# EAGLE design I2C-Level-Converter (EAGLE 7.6.0)
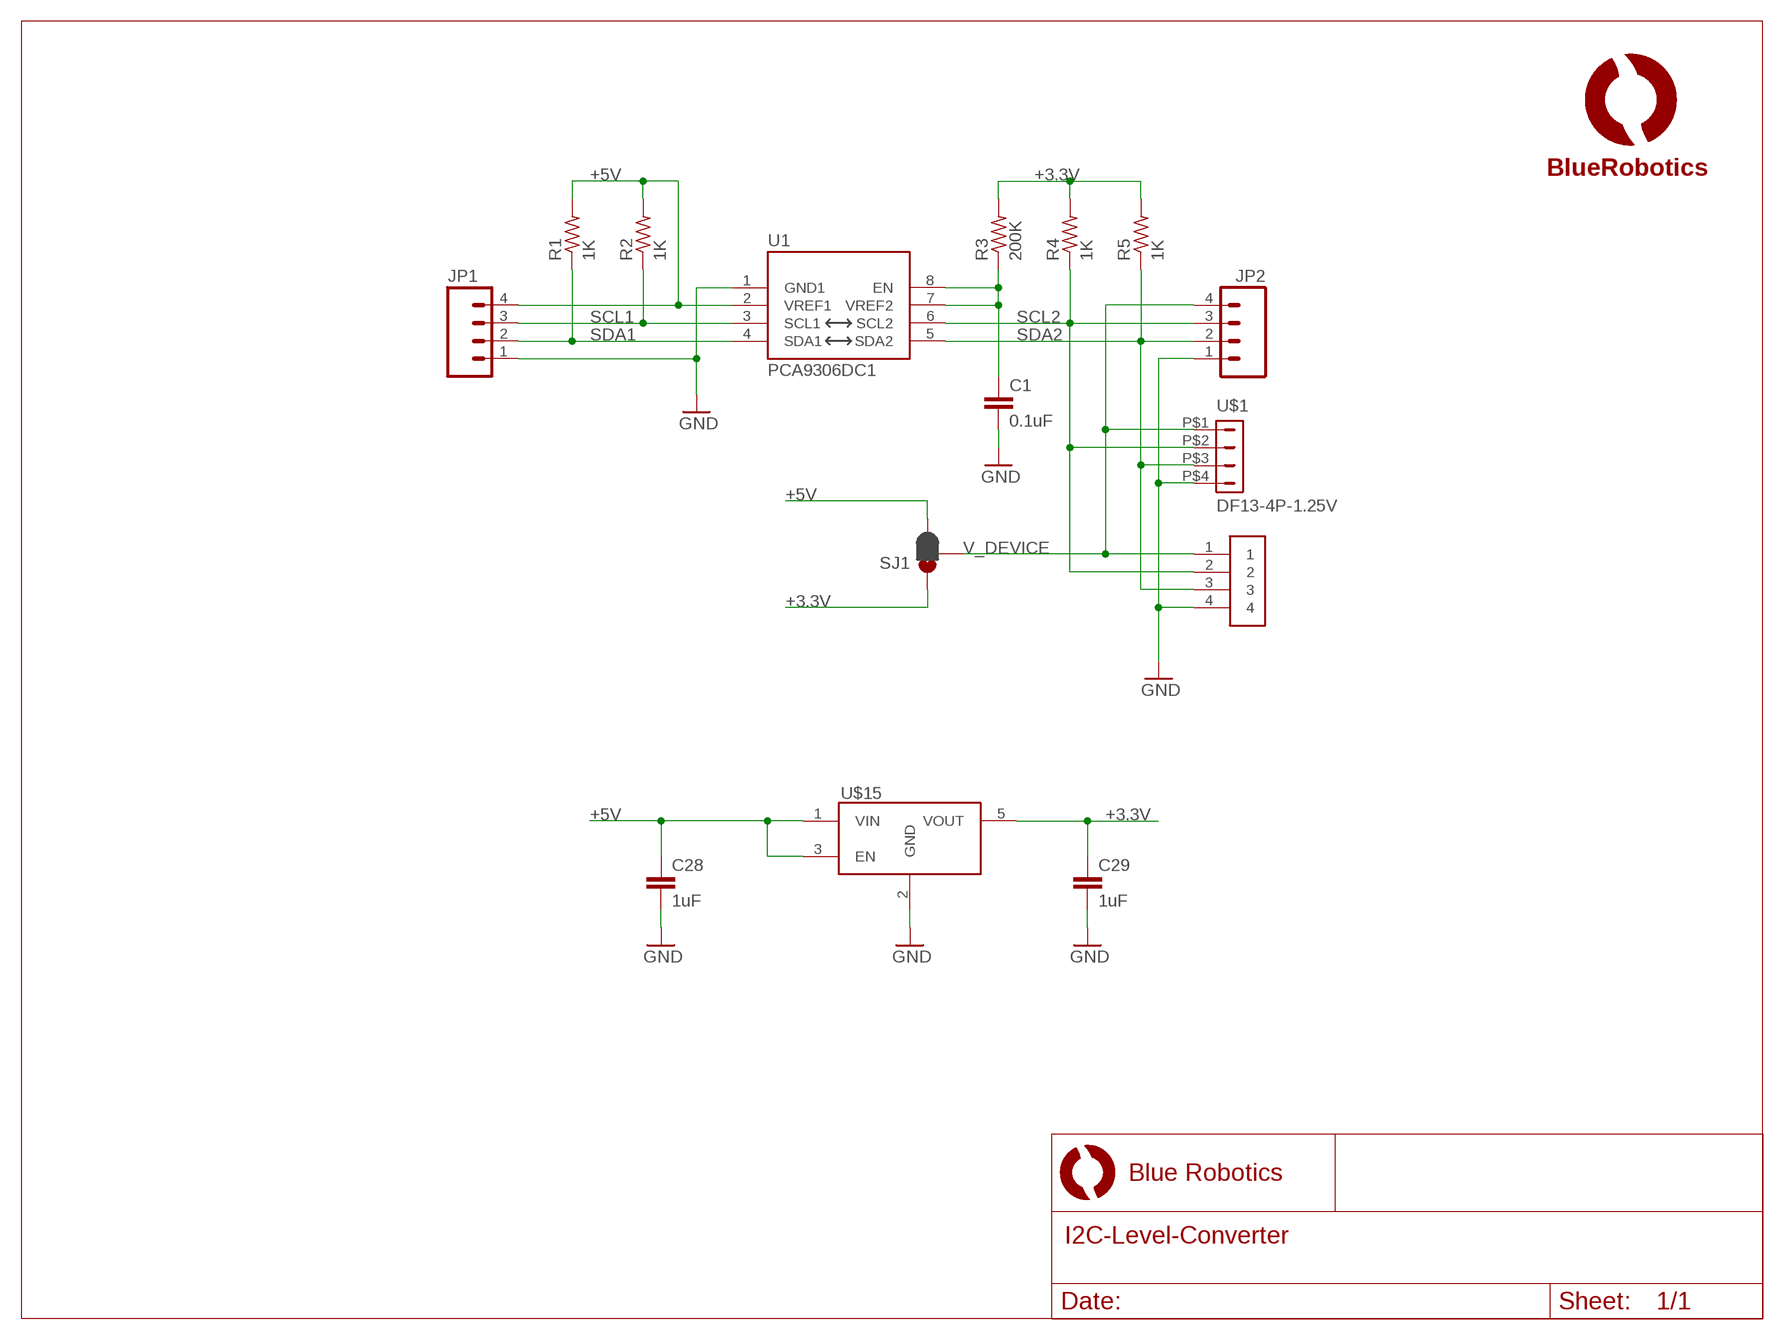
[diagram p0: schematic, sheet 1]

## Parts
C1  0.1uF  C-EUC0603  [C0603]
C28  1uF  CAP0603-CAP  [0603-CAP]
C29  1uF  CAP0603-CAP  [0603-CAP]
JP1  M04PTH  [1X04]
JP2  M04PTH  [1X04]
R1  1K  R-US_R0603  [R0603]
R2  1K  R-US_R0603  [R0603]
R3  200K  R-US_R0603  [R0603]
R4  1K  R-US_R0603  [R0603]
R5  1K  R-US_R0603  [R0603]
SJ1  JUMPER-PAD-3-2OF3_NC_BY_PASTE  [PAD-JUMPER-3-2OF3_NC_BY_PASTE_YES_SILK_FULL_BOX]
U1  PCA9306DC1  PCA9306  [PSOP-8]
U$1  DF13-4P-1.25V  [DF13C-4P-1.25V]
U$2  JST-GH-4SMT  [JST-GH-TOP-4]
U$3  LOGOBR-LOGO-S  [BR-LOGO-SMALL]
U$15  VREG-MIC5365  [SC70-5L]

## Nets
+3.3V: C29.1 R3.2 R4.2 R5.2 SJ1.1 U$15.5(VOUT)
+5V: C28.1 JP1.4 R1.2 R2.2 SJ1.3 U1.2(VREF1) U$15.1(VIN) U$15.3(EN)
GND: C1.2 C28.2 C29.2 JP1.1 JP2.1 U1.1(GND1) U$1.P$4 U$2.4 U$15.2(GND)
N$5: C1.1 R3.1 U1.7(VREF2) U1.8(EN)
SCL1: JP1.3 R2.1 U1.3(SCL1)
SCL2: JP2.3 R4.1 U1.6(SCL2) U$1.P$2 U$2.2
SDA1: JP1.2 R1.1 U1.4(SDA1)
SDA2: JP2.2 R5.1 U1.5(SDA2) U$1.P$3 U$2.3
V_DEVICE: JP2.4 SJ1.2 U$1.P$1 U$2.1

## Library data of the parts
C1 = resistor:C-EU: CAPACITOR, European symbol
C28 C29 = SparkFun-Capacitors:CAP: Capacitor Standard 0603 ceramic capacitor, and 0.1" leaded capacitor.
JP1 JP2 = SparkFun-Connectors:M04: Header 4 Standard 4-pin 0.1" header. Use with straight break away headers (SKU : PRT-00116), right angle break away headers (PRT-00553), swiss pins (PRT-00743), machine pins (PRT-00117), and female headers (PRT-00115). Molex polarized connector foot print use with SKU : PRT-08231 with associated crimp pins and housings. 1MM SMD Version SKU: PRT-10208
R1-R5 = resistor:R-US_: RESISTOR, American symbol
SJ1 = SparkFun-Passives:JUMPER-PAD-3-2OF3_NC_BY_PASTE
U1 = PCA9306DC1:PCA9306: Bidirectional I2C level shifter. NOT compatible with all available part number pinout schemes- DOUBLE CHECK!!!; PROD_ID: IC-10023; VALUE: PCA9306
U$1 = con-hirose-df13:DF13-4P-1.25: DF13-4P 1.25mm Pitch Miniature Crimping Connector.
U$2 = BlueRobotics-JST-GH:JST-GH-4
U$3 = BlueRobotics-Main:LOGO
U$15 = BlueRobotics-Main:VREG-MIC5365

## Board
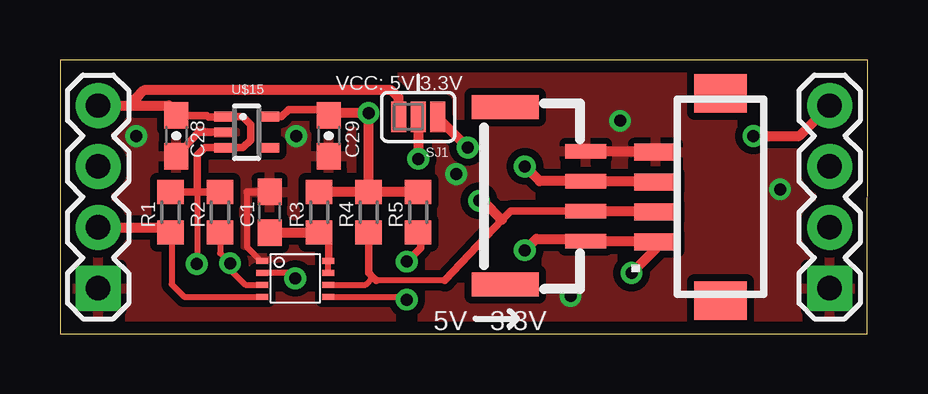
[diagram p1: board, top side]
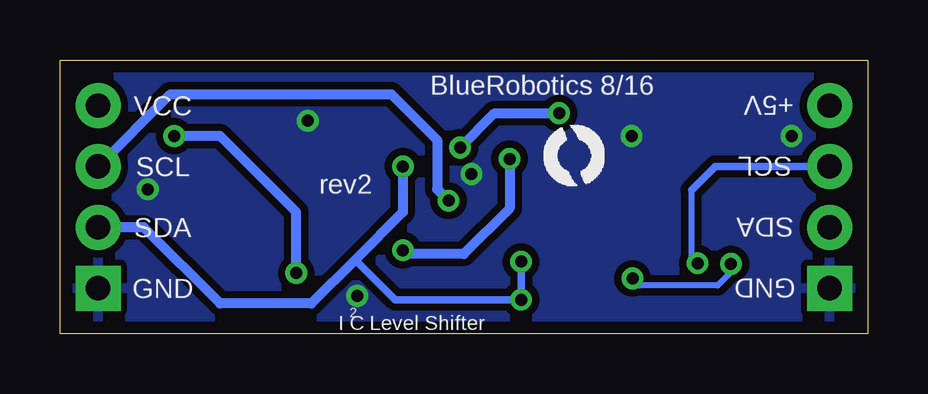
[diagram p2: board, bottom side, seen from below]

Size 33.66 x 11.43 mm. Coordinates in mm from the lower left corner, seen from the top.
Outline: 0,0 33.63,0 33.66,11.43 0,11.43 0,0
Copper layers (1*16): Top 0.035mm / dielectric 1.5mm / Bottom 0.035mm
Design rules "default *": minimum track width 6mil, minimum drill 13mil, track to track 8mil, track to pad 8mil, pad to pad 8mil, via to via 8mil, smd to smd 8mil, copper to edge 20mil, drill to drill 8mil, minimum pad ring 10mil, minimum via ring 8mil, stop-mask expansion 4mil, vias tented up to drill 30mil, thermal gap 10mil

### Footprints (pad centres in the part's own frame; a part is rotated, then mirrored left to right if it is on the bottom)
C0603 = smd 1.1 x 1: 1 -0.85,0; 2 0.85,0
0603-CAP = smd 1.1 x 1: 1 -0.85,0; 2 0.85,0
1X04 = drill 1.016 pad 1.88 square: 1 0,0 | drill 1.016 pad 1.88: 2 2.54,0; 3 5.08,0; 4 7.62,0
R0603 = smd 1 x 1.1: 1 -0.85,0; 2 0.85,0
PAD-JUMPER-3-2OF3_NC_BY_PASTE_YES_SILK_FULL_BOX = smd 0.635 x 1.27: 1 -0.813,0; 2 0,0; 3 0.813,0
PSOP-8 = smd 0.25 x 0.5: 1 -0.73,-1.37; 2 -0.23,-1.37; 3 0.27,-1.37; 4 0.77,-1.37; 5 0.77,1.38; 6 0.27,1.38; 7 -0.23,1.38; 8 -0.73,1.38
DF13C-4P-1.25V = smd 1.6 x 2.2: M$0 4.325,-1.8; M$1 -4.325,-1.8 | smd 0.7 x 1.8: P$1 -1.875,0.9; P$2 -0.625,0.9; P$3 0.625,0.9; P$4 1.875,0.9
JST-GH-TOP-4 = smd 0.6 x 1.7: 1 3.75,0; 2 2.5,0; 3 1.25,0; 4 0,0 | smd 1 x 2.8: MECH1 5.55,-3.35; MECH2 -1.85,-3.35
SC70-5L = smd 0.4 x 0.8: 1 -0.65,-0.95; 2 0,-0.95; 3 0.65,-0.95; 4 0.65,0.95; 5 -0.65,0.95

### Placement (x,y rotation side)
C1  8.73,5.08 90 top
C28  4.85,8.27 270 top
C29  11.2,8.27 270 top
JP1  1.59,1.9 90 top
JP2  32.07,1.9 90 top
R1  4.6,5.08 90 top
R2  6.67,5.08 90 top
R3  10.79,5.08 90 top
R4  12.86,5.08 90 top
R5  14.92,5.08 90 top
SJ1  14.92,9.05 180 top
U1  9.8,2.32 270 top
U$1  25.72,5.71 90 top
U$2  21.91,7.62 270 top
U$3  13.49,6.19 0 bottom
U$15  7.78,8.41 270 top

### Tracks (layer width: path | path; a pad name or v marks a point on that pad's centre or on a via)
+3.3V  (via drill 0.5)
  Top 0.305: U$15.5 9.22,9.06 9.53,9.37 11.01,9.37 11.2,9.18 C29.1 11.24,9.12 11.33,9.21
  Top 0.406: SJ1.1 15.73,9.03 v16.99,7.78 | 11.33,9.21 v12.86,9.21 R4.2 | R5.2 R4.2 | R4.2 R3.2
  Bottom 0.406: v16.99,7.78 15.56,9.21 v12.86,9.21
+5V  (via drill 0.5)
  Top 0.254: 5.71,6.03 5.71,2.93 v5.7,2.92 | v9.8,2.32 9.57,2.55 U1.2
  Top 0.305: 6.84,7.78 7.62,7.78 7.94,8.1 7.94,8.73 7.61,9.06 U$15.1 6.81,9.05 6.19,9.05 6.12,9.12 C28.1 4.85,9.22 4.55,9.52 | 6.84,7.78 U$15.3 | R1.2 5.61,5.93 5.71,6.03 | R2.2 5.82,5.93 5.71,6.03 | 6.84,7.78 6.03,7.78 5.71,7.46 5.71,6.03
  Top 0.406: JP1.4 3.17,9.52 | 3.17,9.52 4.55,9.52 | SJ1.3 14.11,9.86 13.81,10.16 3.49,10.16 3.17,9.84 3.17,9.52
  Bottom 0.254: v5.7,2.92 5.7,2.57 6.25,2.02 9.5,2.02 v9.8,2.32
GND  (via drill 0.5)
  Top 0.254: 7.8,5.92 7.8,3.62 8.37,3.05 U1.1
  Top 0.305: U$15.2 5.77,8.41 C28.2 | 7.8,5.92 7.81,5.93 C1.2
  Top 0.406: U$2.4 24.79,7.62 U$1.P$4
  other vias: 9.84,8.26 3.17,8.26 16.51,6.67 21.27,1.59 30,6.03 23.34,8.89
  pour Top (isolate 0.305): -2.54,-2.22 38.1,-2.22 38.1,14.13 -2.54,14.13
  pour Bottom (isolate 0.305): -2.7,-1.43 37.94,-1.43 38.1,15.56 -2.54,15.56
N$5
  Top 0.254: U1.7 U1.8
  Top 0.305: U1.8 11.2,3.07 11.2,3.92 10.89,4.23 R3.1
  Top 0.406: C1.1 R3.1
SCL1  (via drill 0.5 pad 0.3)
  Top 0.254: U1.3 7.72,2.05 7.09,2.68 v7.09,2.95 6.67,3.37 R2.1
  Bottom 0.254: 7.34,6 7.35,5.99 7.35,3.21 v7.09,2.95
  Bottom 0.305: JP1.3 6.35,6.99 7.34,6
SCL2  (via drill 0.5)
  Top 0.254: 16.03,2.22 13.18,2.22 | U1.6 12.73,2.05 13.04,2.36
  Top 0.305: R4.1 12.86,2.54 13.04,2.36 13.18,2.22 | U$2.2 18.77,5.12 18.41,4.76 16.03,2.22
  Top 0.406: U$2.2 24.79,5.12 U$1.P$2 | v17.46,5.56 17.62,5.56 18.41,4.76
  Bottom 0.406: JP2.3 29.05,10 19.84,10 17.94,8.1 17.94,6.03 v17.46,5.56
SDA1
  Top 0.254: R1.1 4.65,4.23 4.65,2.07 5.17,1.55 U1.4
  Top 0.406: JP1.2 4.55,4.45 R1.1
SDA2  (via drill 0.5)
  Top 0.254: U1.5 14.33,1.55
  Top 0.305: R5.1 15.03,4.13 15.03,3.59 v14.45,3.02 | 14.33,1.55 v14.45,1.43
  Top 0.406: U$1.P$3 24.79,6.37 U$2.3 19.98,6.37 v19.37,6.99
  Bottom 0.305: v14.45,1.43 19.68,1.43 21.35,3.1 | v14.45,3.02 v14.45,1.43 | 14.45,1.27 v14.45,1.43
  Bottom 0.406: v19.37,6.99 19.37,5.08 21.35,3.1 23.18,1.27 26.99,1.27 30.16,4.45 JP2.2
V_DEVICE  (via drill 0.5)
  Top 0.406: v23.81,2.54 24.82,3.55 U$1.P$1 24.79,3.87 U$2.1 21.81,3.97 19.84,3.97 v19.37,3.49 | v28.89,8.26 30.8,8.26 JP2.4 | SJ1.2 v14.92,7.3
  Bottom 0.406: v23.81,2.54 23.81,5.08 26.99,8.26 v28.89,8.26 | v14.92,7.3 14.92,5.24 16.83,3.33 19.21,3.33 v19.37,3.49

### Text on the board
tPlace: VCC: 5V 3.3V | 5V 3.3V
bPlace: BlueRobotics 8/16 | +5V | VCC | SCL | SCL | rev2 | SDA | SDA | GND | GND | 2 | I C Level Shifter